# EAGLE schematic Wordclock (EAGLE 7.2.0)
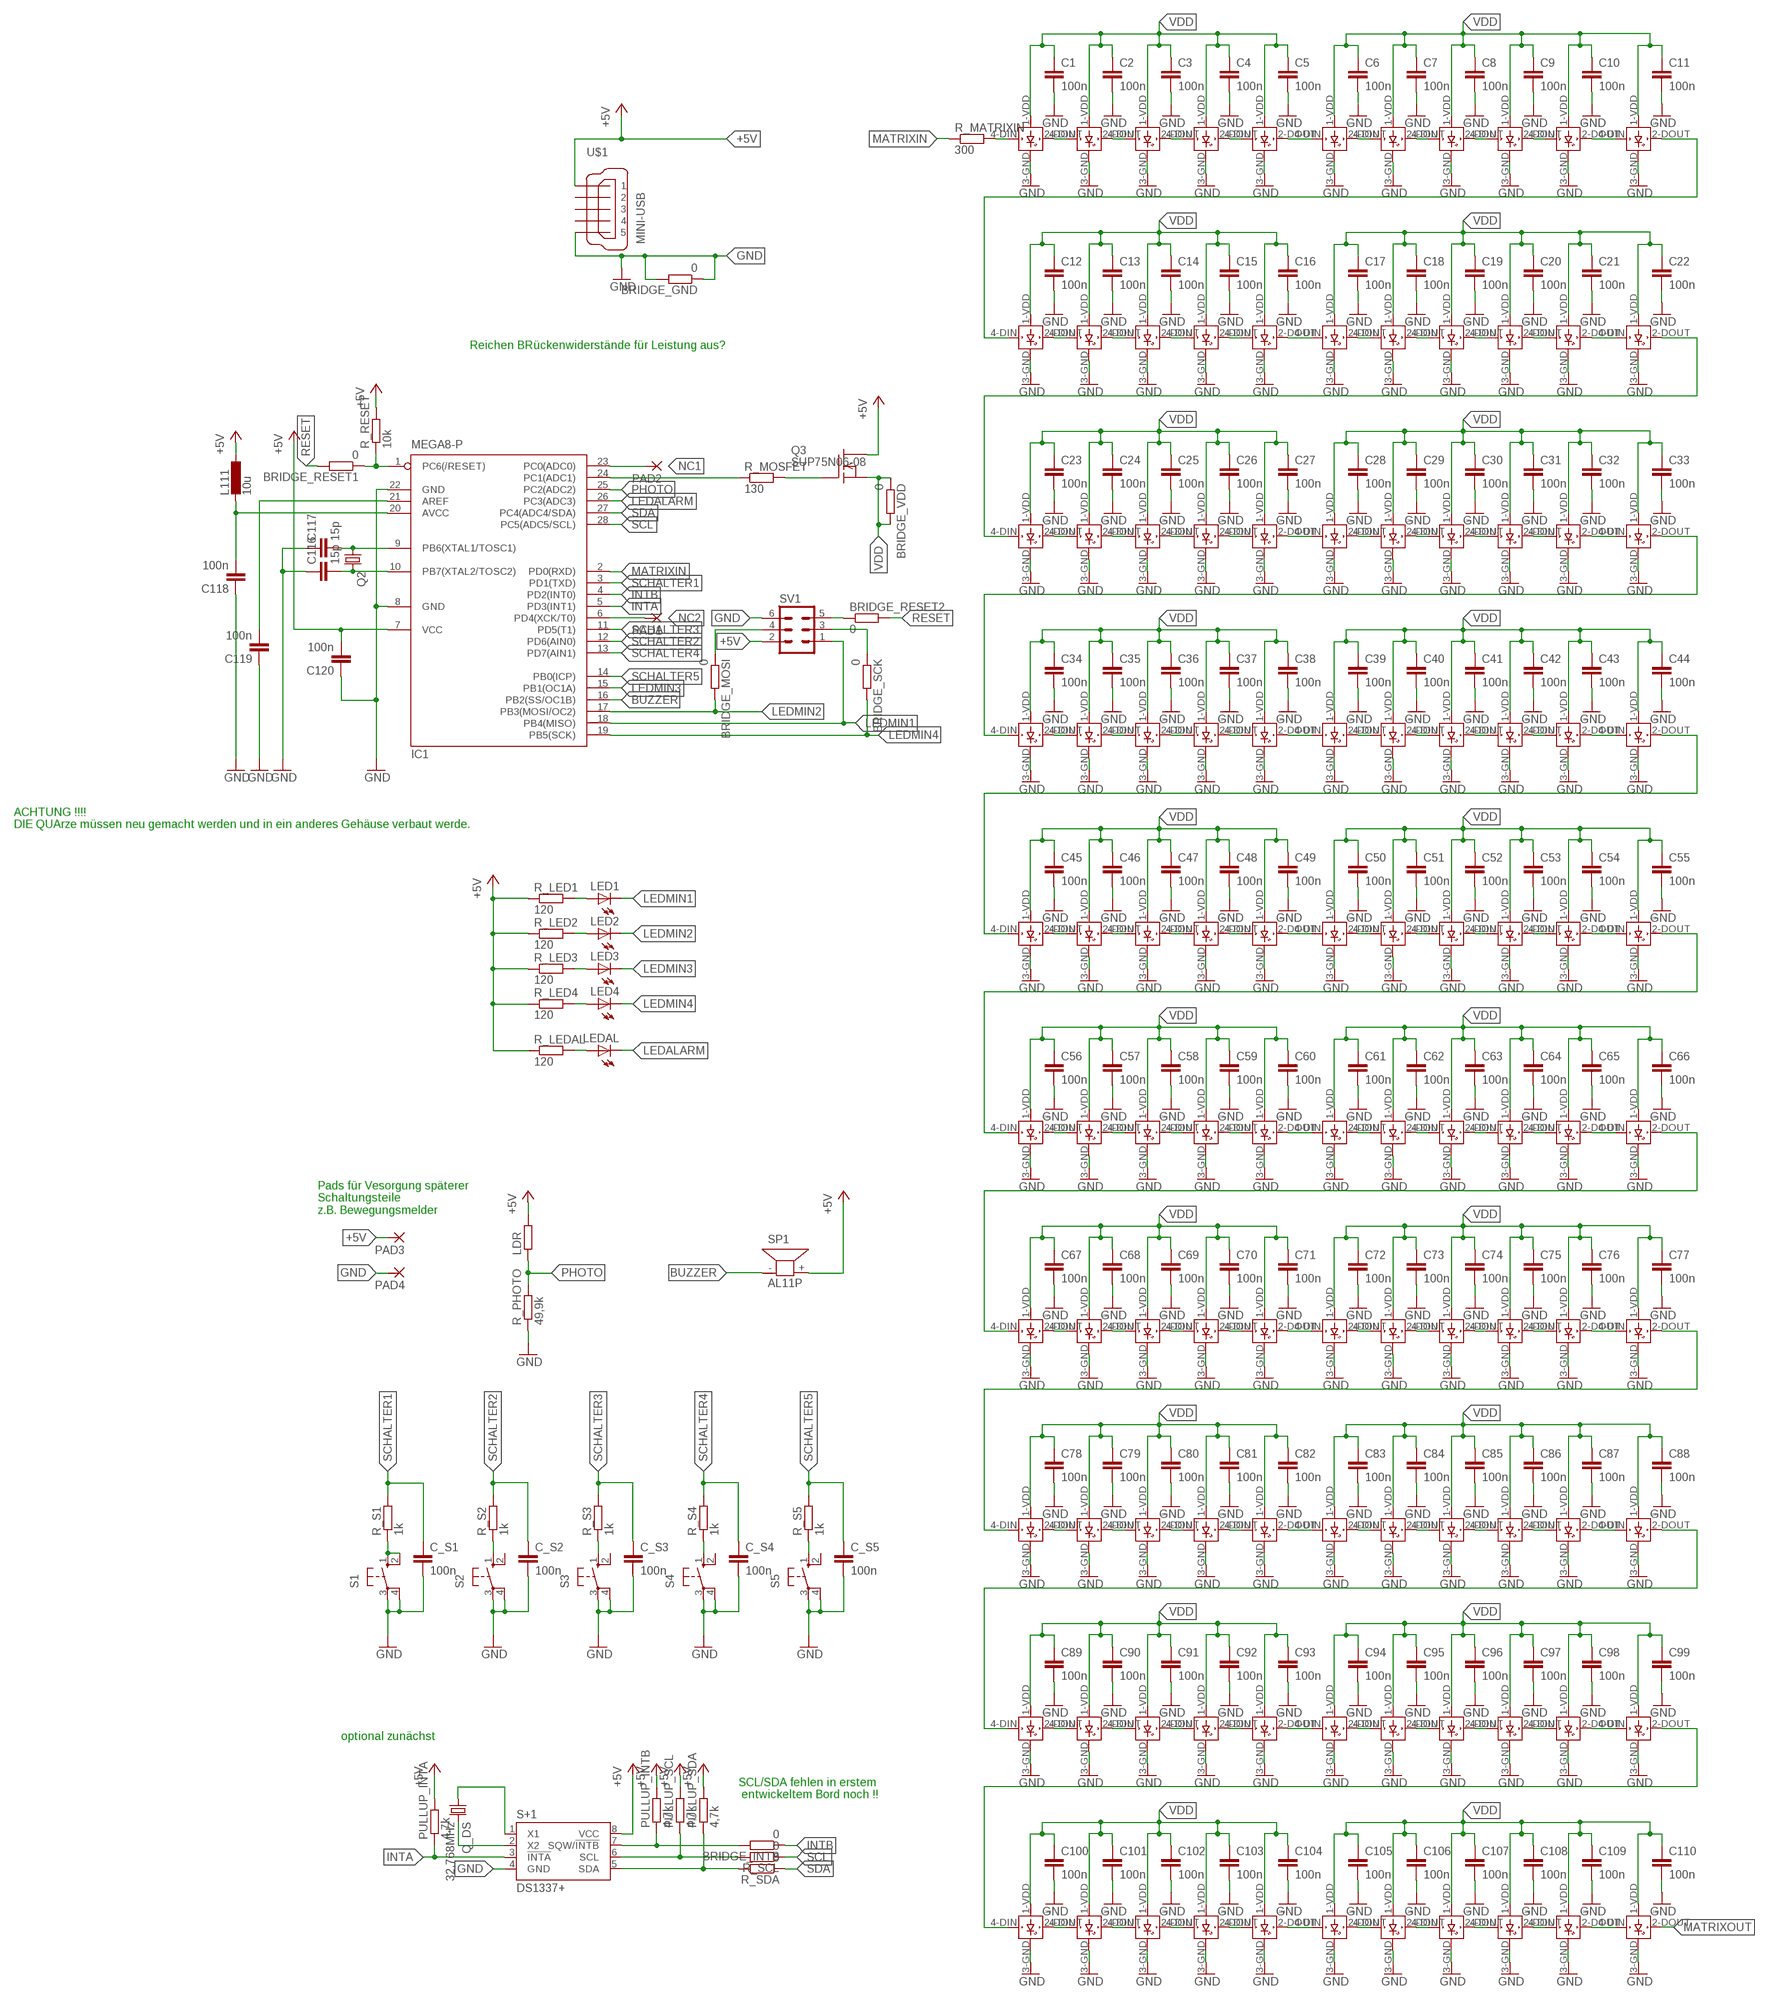
[diagram p0: schematic, sheet 1]

## Parts
BRIDGE_GND  0  R-EU_R1206  [R1206]
BRIDGE_INTB  0  R-EU_R1206  [R1206]
BRIDGE_MOSI  0  R-EU_R1206  [R1206]
BRIDGE_RESET1  0  R-EU_M1206  [M1206]
BRIDGE_RESET2  0  R-EU_R1206  [R1206]
BRIDGE_SCK  0  R-EU_R1206  [R1206]
BRIDGE_VDD  0  R-EU_R1206  [R1206]
C1  100n  C-EUC1310  [C1310]
C2  100n  C-EUC1310  [C1310]
C3  100n  C-EUC1310  [C1310]
C4  100n  C-EUC1310  [C1310]
C5  100n  C-EUC1310  [C1310]
C6  100n  C-EUC1310  [C1310]
C7  100n  C-EUC1310  [C1310]
C8  100n  C-EUC1310  [C1310]
C9  100n  C-EUC1310  [C1310]
C10  100n  C-EUC1310  [C1310]
C11  100n  C-EUC1310  [C1310]
C12  100n  C-EUC1310  [C1310]
C13  100n  C-EUC1310  [C1310]
C14  100n  C-EUC1310  [C1310]
C15  100n  C-EUC1310  [C1310]
C16  100n  C-EUC1310  [C1310]
C17  100n  C-EUC1310  [C1310]
C18  100n  C-EUC1310  [C1310]
C19  100n  C-EUC1310  [C1310]
C20  100n  C-EUC1310  [C1310]
C21  100n  C-EUC1310  [C1310]
C22  100n  C-EUC1310  [C1310]
C23  100n  C-EUC1310  [C1310]
C24  100n  C-EUC1310  [C1310]
C25  100n  C-EUC1310  [C1310]
C26  100n  C-EUC1310  [C1310]
C27  100n  C-EUC1310  [C1310]
C28  100n  C-EUC1310  [C1310]
C29  100n  C-EUC1310  [C1310]
C30  100n  C-EUC1310  [C1310]
C31  100n  C-EUC1310  [C1310]
C32  100n  C-EUC1310  [C1310]
C33  100n  C-EUC1310  [C1310]
C34  100n  C-EUC1310  [C1310]
C35  100n  C-EUC1310  [C1310]
C36  100n  C-EUC1310  [C1310]
C37  100n  C-EUC1310  [C1310]
C38  100n  C-EUC1310  [C1310]
C39  100n  C-EUC1310  [C1310]
C40  100n  C-EUC1310  [C1310]
C41  100n  C-EUC1310  [C1310]
C42  100n  C-EUC1310  [C1310]
C43  100n  C-EUC1310  [C1310]
C44  100n  C-EUC1310  [C1310]
C45  100n  C-EUC1310  [C1310]
C46  100n  C-EUC1310  [C1310]
C47  100n  C-EUC1310  [C1310]
C48  100n  C-EUC1310  [C1310]
C49  100n  C-EUC1310  [C1310]
C50  100n  C-EUC1310  [C1310]
C51  100n  C-EUC1310  [C1310]
C52  100n  C-EUC1310  [C1310]
C53  100n  C-EUC1310  [C1310]
C54  100n  C-EUC1310  [C1310]
C55  100n  C-EUC1310  [C1310]
C56  100n  C-EUC1310  [C1310]
C57  100n  C-EUC1310  [C1310]
C58  100n  C-EUC1310  [C1310]
C59  100n  C-EUC1310  [C1310]
C60  100n  C-EUC1310  [C1310]
C61  100n  C-EUC1310  [C1310]
C62  100n  C-EUC1310  [C1310]
C63  100n  C-EUC1310  [C1310]
C64  100n  C-EUC1310  [C1310]
C65  100n  C-EUC1310  [C1310]
C66  100n  C-EUC1310  [C1310]
C67  100n  C-EUC1310  [C1310]
C68  100n  C-EUC1310  [C1310]
C69  100n  C-EUC1310  [C1310]
C70  100n  C-EUC1310  [C1310]
C71  100n  C-EUC1310  [C1310]
C72  100n  C-EUC1310  [C1310]
C73  100n  C-EUC1310  [C1310]
C74  100n  C-EUC1310  [C1310]
C75  100n  C-EUC1310  [C1310]
C76  100n  C-EUC1310  [C1310]
C77  100n  C-EUC1310  [C1310]
C78  100n  C-EUC1310  [C1310]
C79  100n  C-EUC1310  [C1310]
C80  100n  C-EUC1310  [C1310]
C81  100n  C-EUC1310  [C1310]
C82  100n  C-EUC1310  [C1310]
C83  100n  C-EUC1310  [C1310]
C84  100n  C-EUC1310  [C1310]
C85  100n  C-EUC1310  [C1310]
C86  100n  C-EUC1310  [C1310]
C87  100n  C-EUC1310  [C1310]
C88  100n  C-EUC1310  [C1310]
C89  100n  C-EUC1310  [C1310]
C90  100n  C-EUC1310  [C1310]
C91  100n  C-EUC1310  [C1310]
C92  100n  C-EUC1310  [C1310]
C93  100n  C-EUC1310  [C1310]
C94  100n  C-EUC1310  [C1310]
C95  100n  C-EUC1310  [C1310]
C96  100n  C-EUC1310  [C1310]
C97  100n  C-EUC1310  [C1310]
C98  100n  C-EUC1310  [C1310]
C99  100n  C-EUC1310  [C1310]
C100  100n  C-EUC1310  [C1310]
C101  100n  C-EUC1310  [C1310]
C102  100n  C-EUC1310  [C1310]
C103  100n  C-EUC1310  [C1310]
C104  100n  C-EUC1310  [C1310]
C105  100n  C-EUC1310  [C1310]
C106  100n  C-EUC1310  [C1310]
C107  100n  C-EUC1310  [C1310]
C108  100n  C-EUC1310  [C1310]
C109  100n  C-EUC1310  [C1310]
C110  100n  C-EUC1310  [C1310]
C116  15p  C-EUC0805  [C0805]
C117  15p  C-EUC0805  [C0805]
C118  100n  C-EUC1206  [C1206]
C119  100n  C-EUC0805  [C0805]
C120  100n  C-EUC0805  [C0805]
C_S1  100n  C-EUC1206  [C1206]
C_S2  100n  C-EUC1206  [C1206]
C_S3  100n  C-EUC1206  [C1206]
C_S4  100n  C-EUC1206  [C1206]
C_S5  100n  C-EUC1206  [C1206]
IC1  MEGA8-P  [DIL28-3]
L1  WS2812B  [WS2812B]
L2  WS2812B  [WS2812B]
L3  WS2812B  [WS2812B]
L4  WS2812B  [WS2812B]
L5  WS2812B  [WS2812B]
L6  WS2812B  [WS2812B]
L7  WS2812B  [WS2812B]
L8  WS2812B  [WS2812B]
L9  WS2812B  [WS2812B]
L10  WS2812B  [WS2812B]
L11  WS2812B  [WS2812B]
L12  WS2812B  [WS2812B]
L13  WS2812B  [WS2812B]
L14  WS2812B  [WS2812B]
L15  WS2812B  [WS2812B]
L16  WS2812B  [WS2812B]
L17  WS2812B  [WS2812B]
L18  WS2812B  [WS2812B]
L19  WS2812B  [WS2812B]
L20  WS2812B  [WS2812B]
L21  WS2812B  [WS2812B]
L22  WS2812B  [WS2812B]
L23  WS2812B  [WS2812B]
L24  WS2812B  [WS2812B]
L25  WS2812B  [WS2812B]
L26  WS2812B  [WS2812B]
L27  WS2812B  [WS2812B]
L28  WS2812B  [WS2812B]
L29  WS2812B  [WS2812B]
L30  WS2812B  [WS2812B]
L31  WS2812B  [WS2812B]
L32  WS2812B  [WS2812B]
L33  WS2812B  [WS2812B]
L34  WS2812B  [WS2812B]
L35  WS2812B  [WS2812B]
L36  WS2812B  [WS2812B]
L37  WS2812B  [WS2812B]
L38  WS2812B  [WS2812B]
L39  WS2812B  [WS2812B]
L40  WS2812B  [WS2812B]
L41  WS2812B  [WS2812B]
L42  WS2812B  [WS2812B]
L43  WS2812B  [WS2812B]
L44  WS2812B  [WS2812B]
L45  WS2812B  [WS2812B]
L46  WS2812B  [WS2812B]
L47  WS2812B  [WS2812B]
L48  WS2812B  [WS2812B]
L49  WS2812B  [WS2812B]
L50  WS2812B  [WS2812B]
L51  WS2812B  [WS2812B]
L52  WS2812B  [WS2812B]
L53  WS2812B  [WS2812B]
L54  WS2812B  [WS2812B]
L55  WS2812B  [WS2812B]
L56  WS2812B  [WS2812B]
L57  WS2812B  [WS2812B]
L58  WS2812B  [WS2812B]
L59  WS2812B  [WS2812B]
L60  WS2812B  [WS2812B]
L61  WS2812B  [WS2812B]
L62  WS2812B  [WS2812B]
L63  WS2812B  [WS2812B]
L64  WS2812B  [WS2812B]
L65  WS2812B  [WS2812B]
L66  WS2812B  [WS2812B]
L67  WS2812B  [WS2812B]
L68  WS2812B  [WS2812B]
L69  WS2812B  [WS2812B]
L70  WS2812B  [WS2812B]
L71  WS2812B  [WS2812B]
L72  WS2812B  [WS2812B]
L73  WS2812B  [WS2812B]
L74  WS2812B  [WS2812B]
L75  WS2812B  [WS2812B]
L76  WS2812B  [WS2812B]
L77  WS2812B  [WS2812B]
L78  WS2812B  [WS2812B]
L79  WS2812B  [WS2812B]
L80  WS2812B  [WS2812B]
L81  WS2812B  [WS2812B]
L82  WS2812B  [WS2812B]
L83  WS2812B  [WS2812B]
L84  WS2812B  [WS2812B]
L85  WS2812B  [WS2812B]
L86  WS2812B  [WS2812B]
L87  WS2812B  [WS2812B]
L88  WS2812B  [WS2812B]
L89  WS2812B  [WS2812B]
L90  WS2812B  [WS2812B]
L91  WS2812B  [WS2812B]
L92  WS2812B  [WS2812B]
L93  WS2812B  [WS2812B]
L94  WS2812B  [WS2812B]
L95  WS2812B  [WS2812B]
L96  WS2812B  [WS2812B]
L97  WS2812B  [WS2812B]
L98  WS2812B  [WS2812B]
L99  WS2812B  [WS2812B]
L100  WS2812B  [WS2812B]
L101  WS2812B  [WS2812B]
L102  WS2812B  [WS2812B]
L103  WS2812B  [WS2812B]
L104  WS2812B  [WS2812B]
L105  WS2812B  [WS2812B]
L106  WS2812B  [WS2812B]
L107  WS2812B  [WS2812B]
L108  WS2812B  [WS2812B]
L109  WS2812B  [WS2812B]
L110  WS2812B  [WS2812B]
L111  10u  L-EUL2012C  [L2012C]
LDR  R-EU_0204/5  [0204/5]
LED1  LEDCHIPLED_1206  [CHIPLED_1206]
LED2  LEDCHIPLED_1206  [CHIPLED_1206]
LED3  LEDCHIPLED_1206  [CHIPLED_1206]
LED4  LEDCHIPLED_1206  [CHIPLED_1206]
LEDAL  LEDCHIPLED_1206  [CHIPLED_1206]
PAD1  2,54/1,1  [2,54/1,1]
PAD2  2,54/1,1  [2,54/1,1]
PAD3  2,54/1,1  [2,54/1,1]
PAD4  2,54/1,1  [2,54/1,1]
PULLUP_INTA  4,7k  R-EU_R1206  [R1206]
PULLUP_INTB  4,7k  R-EU_R1206  [R1206]
PULLUP_SCL  4,7k  R-EU_R1206  [R1206]
PULLUP_SDA  4,7k  R-EU_R1206  [R1206]
Q2  CRYSTALHC49S  [HC49/S]
Q3  SUP75N06-08  [TO220]
Q_DS  32,768MHz  CRYSTALHC49S  [HC49/S]
R_LED1  120  R-EU_M1206  [M1206]
R_LED2  120  R-EU_M1206  [M1206]
R_LED3  120  R-EU_M1206  [M1206]
R_LED4  120  R-EU_M1206  [M1206]
R_LEDAL  120  R-EU_M1206  [M1206]
R_MATRIXIN  300  R-EU_R1206  [R1206]
R_MOSFET  130  R-EU_R1206  [R1206]
R_PHOTO  49,9k  R-EU_M1206  [M1206]
R_RESET  10k  R-EU_M1206  [M1206]
R_S1  1k  R-EU_M1206  [M1206]
R_S2  1k  R-EU_M1206  [M1206]
R_S3  1k  R-EU_M1206  [M1206]
R_S4  1k  R-EU_M1206  [M1206]
R_S5  1k  R-EU_M1206  [M1206]
R_SCL  0  R-EU_R1206  [R1206]
R_SDA  0  R-EU_R1206  [R1206]
S1  10-XX  [B3F-10XX]
S2  10-XX  [B3F-10XX]
S3  10-XX  [B3F-10XX]
S4  10-XX  [B3F-10XX]
S5  10-XX  [B3F-10XX]
S+1  DS1337+  [DIL8]
SP1  AL11P  [AL11P]
SV1  ML6L  [ML6L]
U$1  MINI-USB  [MINI-USB]

## Nets
+5V: C120.2 IC1.7(VCC) L111.1 LDR.2 PAD3.1(P) PULLUP_INTA.2 PULLUP_INTB.2 PULLUP_SCL.2 PULLUP_SDA.2 Q3.2(D) R_LED1.1 R_LED2.1 R_LED3.1 R_LED4.1 R_LEDAL.1 R_RESET.2 S+1.8(VCC) SP1.+ SV1.2 U$1.1
BUZZER: IC1.16(PB2(SS/OC1B)) SP1.-
GND: BRIDGE_GND.1 BRIDGE_GND.2 C1.2 C2.2 C3.2 C4.2 C5.2 C6.2 C7.2 C8.2 C9.2 C10.2 C11.2 C12.2 C13.2 C14.2 C15.2 C16.2 C17.2 C18.2 C19.2 C20.2 C21.2 C22.2 C23.2 C24.2 C25.2 C26.2 C27.2 C28.2 C29.2 C30.2 C31.2 C32.2 C33.2 C34.2 C35.2 C36.2 C37.2 C38.2 C39.2 C40.2 C41.2 C42.2 C43.2 C44.2 C45.2 C46.2 C47.2 C48.2 C49.2 C50.2 C51.2 C52.2 C53.2 C54.2 C55.2 C56.2 C57.2 C58.2 C59.2 C60.2 C61.2 C62.2 C63.2 C64.2 C65.2 C66.2 C67.2 C68.2 C69.2 C70.2 C71.2 C72.2 C73.2 C74.2 C75.2 C76.2 C77.2 C78.2 C79.2 C80.2 C81.2 C82.2 C83.2 C84.2 C85.2 C86.2 C87.2 C88.2 C89.2 C90.2 C91.2 C92.2 C93.2 C94.2 C95.2 C96.2 C97.2 C98.2 C99.2 C100.2 C101.2 C102.2 C103.2 C104.2 C105.2 C106.2 C107.2 C108.2 C109.2 C110.2 C116.1 C117.1 C118.1 C119.1 C120.1 C_S1.2 C_S2.2 C_S3.2 C_S4.2 C_S5.2 IC1.8(GND) IC1.22(GND) L1.3-GND(GND) L2.3-GND(GND) L3.3-GND(GND) L4.3-GND(GND) L5.3-GND(GND) L6.3-GND(GND) L7.3-GND(GND) L8.3-GND(GND) L9.3-GND(GND) L10.3-GND(GND) L11.3-GND(GND) L12.3-GND(GND) L13.3-GND(GND) L14.3-GND(GND) L15.3-GND(GND) L16.3-GND(GND) L17.3-GND(GND) L18.3-GND(GND) L19.3-GND(GND) L20.3-GND(GND) L21.3-GND(GND) L22.3-GND(GND) L23.3-GND(GND) L24.3-GND(GND) L25.3-GND(GND) L26.3-GND(GND) L27.3-GND(GND) L28.3-GND(GND) L29.3-GND(GND) L30.3-GND(GND) L31.3-GND(GND) L32.3-GND(GND) L33.3-GND(GND) L34.3-GND(GND) L35.3-GND(GND) L36.3-GND(GND) L37.3-GND(GND) L38.3-GND(GND) L39.3-GND(GND) L40.3-GND(GND) L41.3-GND(GND) L42.3-GND(GND) L43.3-GND(GND) L44.3-GND(GND) L45.3-GND(GND) L46.3-GND(GND) L47.3-GND(GND) L48.3-GND(GND) L49.3-GND(GND) L50.3-GND(GND) L51.3-GND(GND) L52.3-GND(GND) L53.3-GND(GND) L54.3-GND(GND) L55.3-GND(GND) L56.3-GND(GND) L57.3-GND(GND) L58.3-GND(GND) L59.3-GND(GND) L60.3-GND(GND) L61.3-GND(GND) L62.3-GND(GND) L63.3-GND(GND) L64.3-GND(GND) L65.3-GND(GND) L66.3-GND(GND) L67.3-GND(GND) L68.3-GND(GND) L69.3-GND(GND) L70.3-GND(GND) L71.3-GND(GND) L72.3-GND(GND) L73.3-GND(GND) L74.3-GND(GND) L75.3-GND(GND) L76.3-GND(GND) L77.3-GND(GND) L78.3-GND(GND) L79.3-GND(GND) L80.3-GND(GND) L81.3-GND(GND) L82.3-GND(GND) L83.3-GND(GND) L84.3-GND(GND) L85.3-GND(GND) L86.3-GND(GND) L87.3-GND(GND) L88.3-GND(GND) L89.3-GND(GND) L90.3-GND(GND) L91.3-GND(GND) L92.3-GND(GND) L93.3-GND(GND) L94.3-GND(GND) L95.3-GND(GND) L96.3-GND(GND) L97.3-GND(GND) L98.3-GND(GND) L99.3-GND(GND) L100.3-GND(GND) L101.3-GND(GND) L102.3-GND(GND) L103.3-GND(GND) L104.3-GND(GND) L105.3-GND(GND) L106.3-GND(GND) L107.3-GND(GND) L108.3-GND(GND) L109.3-GND(GND) L110.3-GND(GND) PAD4.1(P) R_PHOTO.1 S1.3(P) S1.4(P1) S2.3(P) S2.4(P1) S3.3(P) S3.4(P1) S4.3(P) S4.4(P1) S5.3(P) S5.4(P1) S+1.4(GND) SV1.6 U$1.5
INTA: IC1.5(PD3(INT1)) PULLUP_INTA.1 S+1.3(!INTA)
INTB: BRIDGE_INTB.1 IC1.4(PD2(INT0))
INTB_UNBRIDGED: BRIDGE_INTB.2 PULLUP_INTB.1 S+1.7(SQW/!INTB!)
LEDALARM: IC1.26(PC3(ADC3)) LEDAL.C
LEDMIN1: IC1.18(PB4(MISO)) LED1.C SV1.1
LEDMIN2: BRIDGE_MOSI.2 IC1.17(PB3(MOSI/OC2)) LED2.C
LEDMIN3: IC1.15(PB1(OC1A)) LED3.C
LEDMIN4: BRIDGE_SCK.2 IC1.19(PB5(SCK)) LED4.C
MATRIXIN: IC1.2(PD0(RXD)) R_MATRIXIN.1
MATRIXOUT: L110.2-DOUT(DOUT)
MOSFET_A: IC1.24(PC1(ADC1)) R_MOSFET.1
MOSFET_B: Q3.1(G) R_MOSFET.2
N$1: L1.2-DOUT(DOUT) L2.4-DIN(DIN)
N$2: L2.2-DOUT(DOUT) L3.4-DIN(DIN)
N$3: L3.2-DOUT(DOUT) L4.4-DIN(DIN)
N$4: L4.2-DOUT(DOUT) L5.4-DIN(DIN)
N$5: L6.2-DOUT(DOUT) L7.4-DIN(DIN)
N$6: L5.2-DOUT(DOUT) L6.4-DIN(DIN)
N$7: L7.2-DOUT(DOUT) L8.4-DIN(DIN)
N$8: L8.2-DOUT(DOUT) L9.4-DIN(DIN)
N$9: L9.2-DOUT(DOUT) L10.4-DIN(DIN)
N$10: L10.2-DOUT(DOUT) L11.4-DIN(DIN)
N$11: L12.2-DOUT(DOUT) L13.4-DIN(DIN)
N$12: L13.2-DOUT(DOUT) L14.4-DIN(DIN)
N$13: L14.2-DOUT(DOUT) L15.4-DIN(DIN)
N$14: L15.2-DOUT(DOUT) L16.4-DIN(DIN)
N$15: L16.2-DOUT(DOUT) L17.4-DIN(DIN)
N$16: L17.2-DOUT(DOUT) L18.4-DIN(DIN)
N$17: L18.2-DOUT(DOUT) L19.4-DIN(DIN)
N$18: L19.2-DOUT(DOUT) L20.4-DIN(DIN)
N$19: L20.2-DOUT(DOUT) L21.4-DIN(DIN)
N$20: Q_DS.1 S+1.1(X1)
N$21: Q_DS.2 S+1.2(X2)
N$22: L21.2-DOUT(DOUT) L22.4-DIN(DIN)
N$23: L23.2-DOUT(DOUT) L24.4-DIN(DIN)
N$24: L24.2-DOUT(DOUT) L25.4-DIN(DIN)
N$25: L25.2-DOUT(DOUT) L26.4-DIN(DIN)
N$26: L26.2-DOUT(DOUT) L27.4-DIN(DIN)
N$27: L27.2-DOUT(DOUT) L28.4-DIN(DIN)
N$28: L28.2-DOUT(DOUT) L29.4-DIN(DIN)
N$29: L29.2-DOUT(DOUT) L30.4-DIN(DIN)
N$30: L30.2-DOUT(DOUT) L31.4-DIN(DIN)
N$31: L31.2-DOUT(DOUT) L32.4-DIN(DIN)
N$32: L32.2-DOUT(DOUT) L33.4-DIN(DIN)
N$33: L34.2-DOUT(DOUT) L35.4-DIN(DIN)
N$34: L35.2-DOUT(DOUT) L36.4-DIN(DIN)
N$35: L36.2-DOUT(DOUT) L37.4-DIN(DIN)
N$36: L37.2-DOUT(DOUT) L38.4-DIN(DIN)
N$37: L38.2-DOUT(DOUT) L39.4-DIN(DIN)
N$38: L39.2-DOUT(DOUT) L40.4-DIN(DIN)
N$39: L40.2-DOUT(DOUT) L41.4-DIN(DIN)
N$40: L41.2-DOUT(DOUT) L42.4-DIN(DIN)
N$41: L42.2-DOUT(DOUT) L43.4-DIN(DIN)
N$42: L43.2-DOUT(DOUT) L44.4-DIN(DIN)
N$43: L45.2-DOUT(DOUT) L46.4-DIN(DIN)
N$44: L46.2-DOUT(DOUT) L47.4-DIN(DIN)
N$45: L47.2-DOUT(DOUT) L48.4-DIN(DIN)
N$46: L48.2-DOUT(DOUT) L49.4-DIN(DIN)
N$47: L49.2-DOUT(DOUT) L50.4-DIN(DIN)
N$48: L50.2-DOUT(DOUT) L51.4-DIN(DIN)
N$49: L51.2-DOUT(DOUT) L52.4-DIN(DIN)
N$50: L52.2-DOUT(DOUT) L53.4-DIN(DIN)
N$51: L53.2-DOUT(DOUT) L54.4-DIN(DIN)
N$52: L54.2-DOUT(DOUT) L55.4-DIN(DIN)
N$53: L56.2-DOUT(DOUT) L57.4-DIN(DIN)
N$54: L57.2-DOUT(DOUT) L58.4-DIN(DIN)
N$55: L58.2-DOUT(DOUT) L59.4-DIN(DIN)
N$56: L59.2-DOUT(DOUT) L60.4-DIN(DIN)
N$57: L60.2-DOUT(DOUT) L61.4-DIN(DIN)
N$58: L61.2-DOUT(DOUT) L62.4-DIN(DIN)
N$59: L62.2-DOUT(DOUT) L63.4-DIN(DIN)
N$60: L63.2-DOUT(DOUT) L64.4-DIN(DIN)
N$61: L64.2-DOUT(DOUT) L65.4-DIN(DIN)
N$62: L65.2-DOUT(DOUT) L66.4-DIN(DIN)
N$63: L67.2-DOUT(DOUT) L68.4-DIN(DIN)
N$64: L68.2-DOUT(DOUT) L69.4-DIN(DIN)
N$65: L69.2-DOUT(DOUT) L70.4-DIN(DIN)
N$66: L70.2-DOUT(DOUT) L71.4-DIN(DIN)
N$67: L71.2-DOUT(DOUT) L72.4-DIN(DIN)
N$68: L72.2-DOUT(DOUT) L73.4-DIN(DIN)
N$69: L73.2-DOUT(DOUT) L74.4-DIN(DIN)
N$70: L74.2-DOUT(DOUT) L75.4-DIN(DIN)
N$71: L75.2-DOUT(DOUT) L76.4-DIN(DIN)
N$72: L76.2-DOUT(DOUT) L77.4-DIN(DIN)
N$73: L78.2-DOUT(DOUT) L79.4-DIN(DIN)
N$74: L79.2-DOUT(DOUT) L80.4-DIN(DIN)
N$75: L80.2-DOUT(DOUT) L81.4-DIN(DIN)
N$76: L81.2-DOUT(DOUT) L82.4-DIN(DIN)
N$77: L82.2-DOUT(DOUT) L83.4-DIN(DIN)
N$78: L83.2-DOUT(DOUT) L84.4-DIN(DIN)
N$79: L84.2-DOUT(DOUT) L85.4-DIN(DIN)
N$80: L85.2-DOUT(DOUT) L86.4-DIN(DIN)
N$81: L86.2-DOUT(DOUT) L87.4-DIN(DIN)
N$82: L87.2-DOUT(DOUT) L88.4-DIN(DIN)
N$83: L89.2-DOUT(DOUT) L90.4-DIN(DIN)
N$84: L90.2-DOUT(DOUT) L91.4-DIN(DIN)
N$85: L91.2-DOUT(DOUT) L92.4-DIN(DIN)
N$86: L92.2-DOUT(DOUT) L93.4-DIN(DIN)
N$87: L93.2-DOUT(DOUT) L94.4-DIN(DIN)
N$88: L94.2-DOUT(DOUT) L95.4-DIN(DIN)
N$89: L95.2-DOUT(DOUT) L96.4-DIN(DIN)
N$90: L96.2-DOUT(DOUT) L97.4-DIN(DIN)
N$91: L97.2-DOUT(DOUT) L98.4-DIN(DIN)
N$92: L98.2-DOUT(DOUT) L99.4-DIN(DIN)
N$93: L100.2-DOUT(DOUT) L101.4-DIN(DIN)
N$94: L101.2-DOUT(DOUT) L102.4-DIN(DIN)
N$95: L102.2-DOUT(DOUT) L103.4-DIN(DIN)
N$96: L103.2-DOUT(DOUT) L104.4-DIN(DIN)
N$97: L104.2-DOUT(DOUT) L105.4-DIN(DIN)
N$98: L105.2-DOUT(DOUT) L106.4-DIN(DIN)
N$99: L106.2-DOUT(DOUT) L107.4-DIN(DIN)
N$100: L107.2-DOUT(DOUT) L108.4-DIN(DIN)
N$101: L108.2-DOUT(DOUT) L109.4-DIN(DIN)
N$102: L109.2-DOUT(DOUT) L110.4-DIN(DIN)
N$103: L11.2-DOUT(DOUT) L12.4-DIN(DIN)
N$104: L22.2-DOUT(DOUT) L23.4-DIN(DIN)
N$105: L33.2-DOUT(DOUT) L34.4-DIN(DIN)
N$106: L44.2-DOUT(DOUT) L45.4-DIN(DIN)
N$107: L55.2-DOUT(DOUT) L56.4-DIN(DIN)
N$108: L66.2-DOUT(DOUT) L67.4-DIN(DIN)
N$109: L77.2-DOUT(DOUT) L78.4-DIN(DIN)
N$110: L88.2-DOUT(DOUT) L89.4-DIN(DIN)
N$111: L99.2-DOUT(DOUT) L100.4-DIN(DIN)
N$112: PULLUP_SCL.1 R_SCL.2 S+1.6(SCL)
N$113: C118.2 IC1.20(AVCC) L111.2
N$114: LED1.A R_LED1.2
N$115: LED2.A R_LED2.2
N$116: LED3.A R_LED3.2
N$117: LED4.A R_LED4.2
N$118: LEDAL.A R_LEDAL.2
N$119: R_S1.1 S1.1(S) S1.2(S1)
N$120: R_S2.1 S2.1(S)
N$121: R_S3.1 S3.1(S)
N$122: R_S4.1 S4.1(S)
N$123: C119.2 IC1.21(AREF)
N$124: PULLUP_SDA.1 R_SDA.2 S+1.5(SDA)
N$125: BRIDGE_RESET1.1 IC1.1(PC6(/RESET)) R_RESET.1
N$126: R_S5.1 S5.1(S)
N$127: BRIDGE_MOSI.1 SV1.4
N$128: BRIDGE_SCK.1 SV1.3
N$129: BRIDGE_RESET2.1 SV1.5
N$130: L1.4-DIN(DIN) R_MATRIXIN.2
N$136: C117.2 IC1.9(PB6(XTAL1/TOSC1)) Q2.1
N$137: C116.2 IC1.10(PB7(XTAL2/TOSC2)) Q2.2
NC1: IC1.23(PC0(ADC0)) PAD2.1(P)
NC2: IC1.6(PD4(XCK/T0)) PAD1.1(P)
PHOTO: IC1.25(PC2(ADC2)) LDR.1 R_PHOTO.2
RESET: BRIDGE_RESET1.2 BRIDGE_RESET2.2
SCHALTER1: C_S1.1 IC1.3(PD1(TXD)) R_S1.2
SCHALTER2: C_S2.1 IC1.12(PD6(AIN0)) R_S2.2
SCHALTER3: C_S3.1 IC1.11(PD5(T1)) R_S3.2
SCHALTER4: C_S4.1 IC1.13(PD7(AIN1)) R_S4.2
SCHALTER5: C_S5.1 IC1.14(PB0(ICP)) R_S5.2
SCL: IC1.28(PC5(ADC5/SCL)) R_SCL.1
SDA: IC1.27(PC4(ADC4/SDA)) R_SDA.1
VDD: BRIDGE_VDD.1 BRIDGE_VDD.2 C1.1 C2.1 C3.1 C4.1 C5.1 C6.1 C7.1 C8.1 C9.1 C10.1 C11.1 C12.1 C13.1 C14.1 C15.1 C16.1 C17.1 C18.1 C19.1 C20.1 C21.1 C22.1 C23.1 C24.1 C25.1 C26.1 C27.1 C28.1 C29.1 C30.1 C31.1 C32.1 C33.1 C34.1 C35.1 C36.1 C37.1 C38.1 C39.1 C40.1 C41.1 C42.1 C43.1 C44.1 C45.1 C46.1 C47.1 C48.1 C49.1 C50.1 C51.1 C52.1 C53.1 C54.1 C55.1 C56.1 C57.1 C58.1 C59.1 C60.1 C61.1 C62.1 C63.1 C64.1 C65.1 C66.1 C67.1 C68.1 C69.1 C70.1 C71.1 C72.1 C73.1 C74.1 C75.1 C76.1 C77.1 C78.1 C79.1 C80.1 C81.1 C82.1 C83.1 C84.1 C85.1 C86.1 C87.1 C88.1 C89.1 C90.1 C91.1 C92.1 C93.1 C94.1 C95.1 C96.1 C97.1 C98.1 C99.1 C100.1 C101.1 C102.1 C103.1 C104.1 C105.1 C106.1 C107.1 C108.1 C109.1 C110.1 L1.1-VDD(VDD) L2.1-VDD(VDD) L3.1-VDD(VDD) L4.1-VDD(VDD) L5.1-VDD(VDD) L6.1-VDD(VDD) L7.1-VDD(VDD) L8.1-VDD(VDD) L9.1-VDD(VDD) L10.1-VDD(VDD) L11.1-VDD(VDD) L12.1-VDD(VDD) L13.1-VDD(VDD) L14.1-VDD(VDD) L15.1-VDD(VDD) L16.1-VDD(VDD) L17.1-VDD(VDD) L18.1-VDD(VDD) L19.1-VDD(VDD) L20.1-VDD(VDD) L21.1-VDD(VDD) L22.1-VDD(VDD) L23.1-VDD(VDD) L24.1-VDD(VDD) L25.1-VDD(VDD) L26.1-VDD(VDD) L27.1-VDD(VDD) L28.1-VDD(VDD) L29.1-VDD(VDD) L30.1-VDD(VDD) L31.1-VDD(VDD) L32.1-VDD(VDD) L33.1-VDD(VDD) L34.1-VDD(VDD) L35.1-VDD(VDD) L36.1-VDD(VDD) L37.1-VDD(VDD) L38.1-VDD(VDD) L39.1-VDD(VDD) L40.1-VDD(VDD) L41.1-VDD(VDD) L42.1-VDD(VDD) L43.1-VDD(VDD) L44.1-VDD(VDD) L45.1-VDD(VDD) L46.1-VDD(VDD) L47.1-VDD(VDD) L48.1-VDD(VDD) L49.1-VDD(VDD) L50.1-VDD(VDD) L51.1-VDD(VDD) L52.1-VDD(VDD) L53.1-VDD(VDD) L54.1-VDD(VDD) L55.1-VDD(VDD) L56.1-VDD(VDD) L57.1-VDD(VDD) L58.1-VDD(VDD) L59.1-VDD(VDD) L60.1-VDD(VDD) L61.1-VDD(VDD) L62.1-VDD(VDD) L63.1-VDD(VDD) L64.1-VDD(VDD) L65.1-VDD(VDD) L66.1-VDD(VDD) L67.1-VDD(VDD) L68.1-VDD(VDD) L69.1-VDD(VDD) L70.1-VDD(VDD) L71.1-VDD(VDD) L72.1-VDD(VDD) L73.1-VDD(VDD) L74.1-VDD(VDD) L75.1-VDD(VDD) L76.1-VDD(VDD) L77.1-VDD(VDD) L78.1-VDD(VDD) L79.1-VDD(VDD) L80.1-VDD(VDD) L81.1-VDD(VDD) L82.1-VDD(VDD) L83.1-VDD(VDD) L84.1-VDD(VDD) L85.1-VDD(VDD) L86.1-VDD(VDD) L87.1-VDD(VDD) L88.1-VDD(VDD) L89.1-VDD(VDD) L90.1-VDD(VDD) L91.1-VDD(VDD) L92.1-VDD(VDD) L93.1-VDD(VDD) L94.1-VDD(VDD) L95.1-VDD(VDD) L96.1-VDD(VDD) L97.1-VDD(VDD) L98.1-VDD(VDD) L99.1-VDD(VDD) L100.1-VDD(VDD) L101.1-VDD(VDD) L102.1-VDD(VDD) L103.1-VDD(VDD) L104.1-VDD(VDD) L105.1-VDD(VDD) L106.1-VDD(VDD) L107.1-VDD(VDD) L108.1-VDD(VDD) L109.1-VDD(VDD) L110.1-VDD(VDD) Q3.3(S)
Unconnected: S2.2(S1) S3.2(S1) S4.2(S1) S5.2(S1) U$1.2 U$1.3 U$1.4

## Notes on the sheet
- Reichen BRückenwiderstände für Leistung aus?
- ACHTUNG !!!!
  DIE QUArze müssen neu gemacht werden und in ein anderes Gehäuse verbaut werde.
- Pads für Vesorgung späterer
  Schaltungsteile
  z.B. Bewegungsmelder
- optional zunächst
- SCL/SDA fehlen in erstem
   entwickeltem Bord noch !!

## Library data of the parts
BRIDGE_GND BRIDGE_INTB BRIDGE_MOSI BRIDGE_RESET1 BRIDGE_RESET2 BRIDGE_SCK BRIDGE_VDD LDR PULLUP_INTA PULLUP_INTB PULLUP_SCL PULLUP_SDA R_LED1-R_LED4 R_LEDAL R_MATRIXIN R_MOSFET R_PHOTO R_RESET R_S1-R_S5 R_SCL R_SDA = rcl:R-EU_: RESISTOR, European symbol
C1-C110 C116-C120 C_S1-C_S5 = rcl:C-EU: CAPACITOR, European symbol
IC1 = atmel:MEGA8-P: MICROCONTROLLER 8 Kbytes FLASH, 1 kbytes SRAM, 512 bytes EEPROM, USART, 4-channel 10 bit ADC, 2-channel 8 bit ADC Pin compatible with Atmega48, ATMega88, ATMega168 Source: avr.lbr; OC_FARNELL: unknown; OC_NEWARK: unknown
L1-L110 = adafruit:WS2812B
L111 = rcl:L-EU: INDUCTOR, European symbol
LED1-LED4 LEDAL = led:LED: LED OSRAM: - CHIPLED LG R971, LG N971, LY N971, LG Q971, LY Q971, LO R971, LY R971 LH N974, LH R974 LS Q976, LO Q976, LY Q976 LO Q996 - Hyper CHIPLED LW Q18S LB Q993, LB Q99A, LB R99A - SideLED LS A670, LO A670, LY A670, LG A670, LP A670 LB A673, LV A673, LT A673, LW A673 LH A674 LY A675 LS A676, LA A676, LO A676, LY A676, LW A676 LS A679, LY A679, LG A679 - Hyper Micro SIDELED® LS Y876, LA Y876, LO Y876, LY Y876 LT Y87S - SmartLED LW L88C, LW L88S LB L89C, LB L89S, LG L890 LS L89K, LO L89K, LY L89K LS L896, LA L896, LO L896, LY L896 - TOPLED LS T670, LO T670, LY T670, LG T670, LP T670 LSG T670, LSP T670, LSY T670, LOP T670, LYG T670 LG T671, LOG T671, LSG T671 LB T673, LV T673, LT T673, LW T673 LH T674 LS T676, LA T676, LO T676, LY T676, LB T676, LH T676, LSB T676, LW T676 LB T67C, LV T67C, LT T67C, LS T67K, LO T67K, LY T67K, LW E67C LS E67B, LA E67B, LO E67B, LY E67B, LB E67C, LV E67C, LT E67C LW T67C LS T679, LY T679, LG T679 LS T770, LO T770, LY T770, LG T770, LP T770 LB T773, LV T773, LT T773, LW T773 LH T774 LS E675, LA E675, LY E675, LS T675 LS T776, LA T776, LO T776, LY T776, LB T776 LHGB T686 LT T68C, LB T68C - Hyper Mini TOPLED® LB M676 - Mini TOPLED Santana® LG M470 LS M47K, LO M47K, LY M47K Source: http://www.osram.convergy.de LUXEON: - LUMILED® LXK2-PW12-R00, LXK2-PW12-S00, LXK2-PW14-U00, LXK2-PW14-V00 LXK2-PM12-R00, LXK2-PM12-S00, LXK2-PM14-U00 LXK2-PE12-Q00, LXK2-PE12-R00, LXK2-PE12-S00, LXK2-PE14-T00, LXK2-PE14-U00 LXK2-PB12-K00, LXK2-PB12-L00, LXK2-PB12-M00, LXK2-PB14-N00, LXK2-PB14-P00, LXK2-PB14-Q00 LXK2-PR12-L00, LXK2-PR12-M00, LXK2-PR14-Q00, LXK2-PR14-R00 LXK2-PD12-Q00, LXK2-PD12-R00, LXK2-PD12-S00 LXK2-PH12-R00, LXK2-PH12-S00 LXK2-PL12-P00, LXK2-PL12-Q00, LXK2-PL12-R00 Source: www.luxeon.com KINGBRIGHT: KA-3528ASYC Source: www.kingbright.com
PAD1-PAD4 = wirepad:2,54/1,1: THROUGH-HOLE PAD
Q2 Q_DS = crystal:CRYSTAL: CRYSTAL; OC_FARNELL: 1667008; OC_NEWARK: unknown
Q3 = transistor-fet:SUP75N06-08: N-Channel Enhancement MOSFET 60V; 75A; 0,008Ohm
S1-S5 = switch-omron:10-XX: OMRON SWITCH; MPN: B3F-1000; OC_FARNELL: 176432; OC_NEWARK: 36M3542
S+1 = eagle-library-edeca.net-v5:DS1337: DS1337 I2C serial real-time clock Low-power clock/calendar with two programmable time-of-day alarms and a programmable square-wave output. http://pdfserv.maxim-ic.com/en/ds/DS1337-DS1337C.pdf
SP1 = buzzer:AL11P: SPEAKER Source: Buerklin; OC_FARNELL: unknown; OC_NEWARK: unknown
SV1 = con-harting-ml:ML6: HARTING; OC_FARNELL: unknown; OC_NEWARK: unknown
U$1 = eagle-library-edeca.net-v5:MINI-USB: Mini USB connector (Kyocera part: 24 5141 005 000 863+) Farnell order code: 1558179